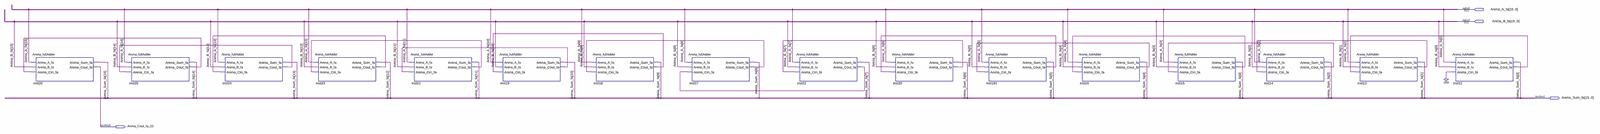
[diagram p0: schematic sheet, whole]
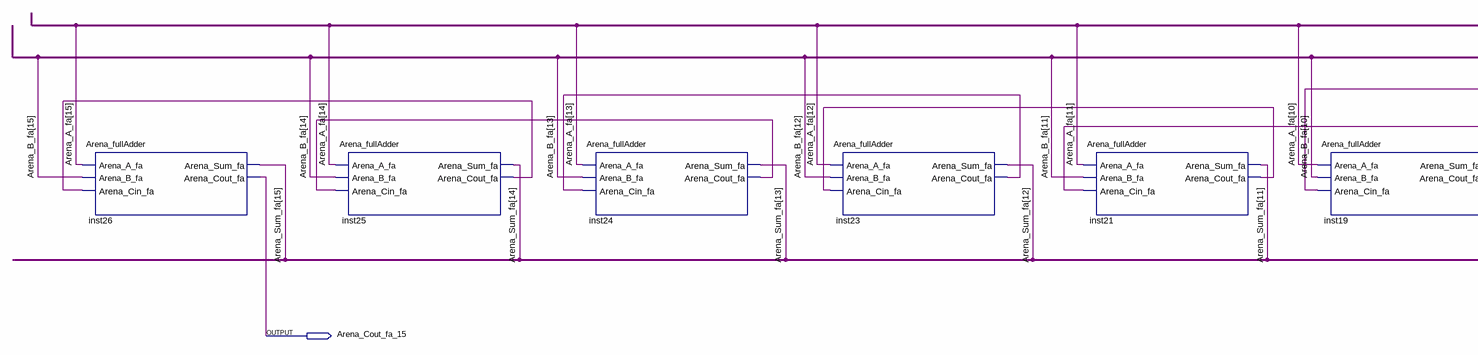
[diagram p1: schematic sheet, left part]
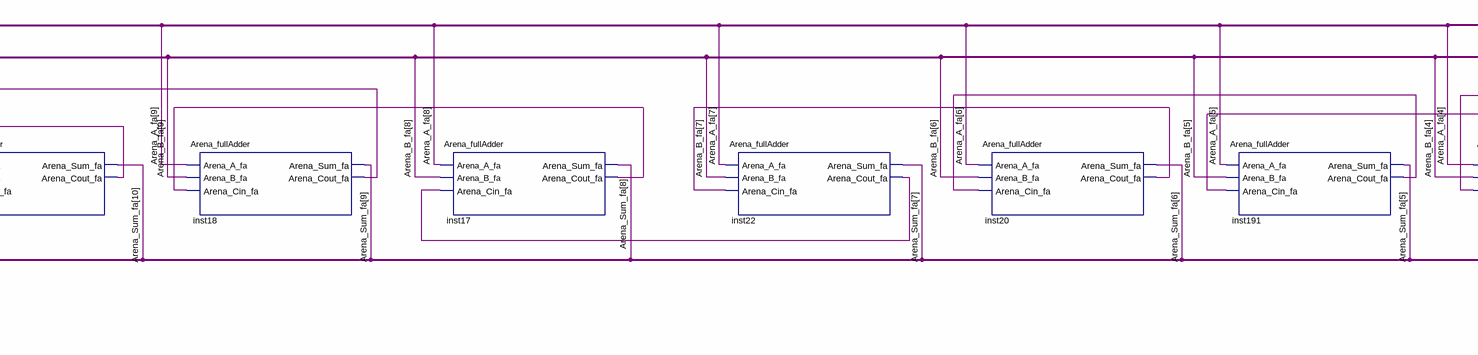
[diagram p2: schematic sheet, centre part]
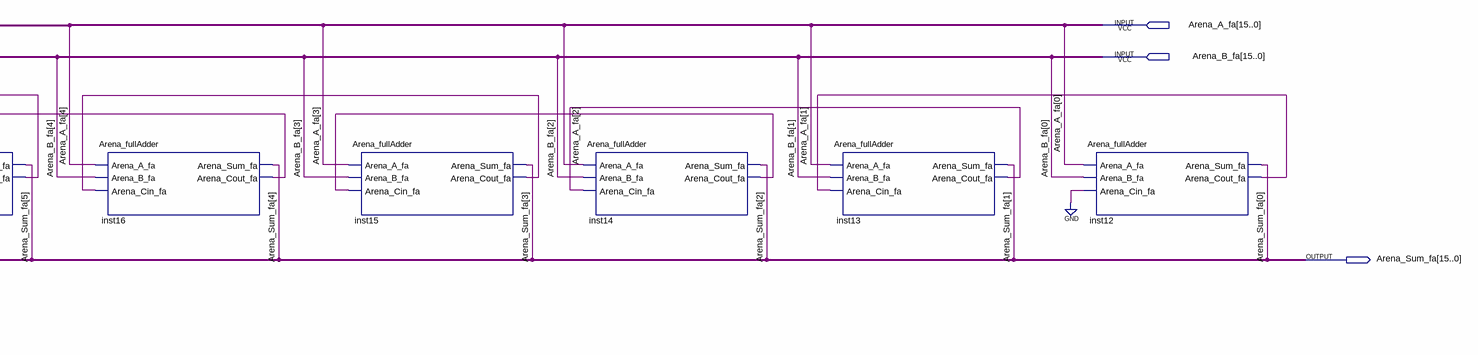
[diagram p3: schematic sheet, right part]
// Quartus schematic Arena_16bitAdder.bdf as structural Verilog: 16 symbols, 4 pins
module Arena_16bitAdder (
  input  [15:0] Arena_A_fa,
  input  [15:0] Arena_B_fa,
  output [15:0] Arena_Sum_fa,
  output Arena_Cout_fa_15
);

  wire inst12_arena_cout_fa, inst13_arena_cout_fa, inst14_arena_cout_fa, inst15_arena_cout_fa,
       inst16_arena_cout_fa, inst17_arena_cout_fa, inst18_arena_cout_fa, inst19_arena_cout_fa,
       inst20_arena_cout_fa, inst21_arena_cout_fa, inst22_arena_cout_fa, inst23_arena_cout_fa,
       inst24_arena_cout_fa, inst25_arena_cout_fa, inst191_arena_cout_fa;

  Arena_fullAdder inst26 (
    .Arena_A_fa(Arena_A_fa[15]), .Arena_B_fa(Arena_B_fa[15]), .Arena_Cin_fa(inst25_arena_cout_fa),
    .Arena_Sum_fa(Arena_Sum_fa[15]), .Arena_Cout_fa(Arena_Cout_fa_15));
  Arena_fullAdder inst25 (
    .Arena_A_fa(Arena_A_fa[14]), .Arena_B_fa(Arena_B_fa[14]), .Arena_Cin_fa(inst24_arena_cout_fa),
    .Arena_Sum_fa(Arena_Sum_fa[14]), .Arena_Cout_fa(inst25_arena_cout_fa));
  Arena_fullAdder inst24 (
    .Arena_A_fa(Arena_A_fa[13]), .Arena_B_fa(Arena_B_fa[13]), .Arena_Cin_fa(inst23_arena_cout_fa),
    .Arena_Sum_fa(Arena_Sum_fa[13]), .Arena_Cout_fa(inst24_arena_cout_fa));
  Arena_fullAdder inst23 (
    .Arena_A_fa(Arena_A_fa[12]), .Arena_B_fa(Arena_B_fa[12]), .Arena_Cin_fa(inst21_arena_cout_fa),
    .Arena_Sum_fa(Arena_Sum_fa[12]), .Arena_Cout_fa(inst23_arena_cout_fa));
  Arena_fullAdder inst21 (
    .Arena_A_fa(Arena_A_fa[11]), .Arena_B_fa(Arena_B_fa[11]), .Arena_Cin_fa(inst19_arena_cout_fa),
    .Arena_Sum_fa(Arena_Sum_fa[11]), .Arena_Cout_fa(inst21_arena_cout_fa));
  Arena_fullAdder inst19 (
    .Arena_A_fa(Arena_A_fa[10]), .Arena_B_fa(Arena_B_fa[10]), .Arena_Cin_fa(inst18_arena_cout_fa),
    .Arena_Sum_fa(Arena_Sum_fa[10]), .Arena_Cout_fa(inst19_arena_cout_fa));
  Arena_fullAdder inst18 (
    .Arena_A_fa(Arena_A_fa[9]), .Arena_B_fa(Arena_B_fa[9]), .Arena_Cin_fa(inst17_arena_cout_fa),
    .Arena_Sum_fa(Arena_Sum_fa[9]), .Arena_Cout_fa(inst18_arena_cout_fa));
  Arena_fullAdder inst17 (
    .Arena_A_fa(Arena_A_fa[8]), .Arena_B_fa(Arena_B_fa[8]), .Arena_Cin_fa(inst22_arena_cout_fa),
    .Arena_Sum_fa(Arena_Sum_fa[8]), .Arena_Cout_fa(inst17_arena_cout_fa));
  Arena_fullAdder inst22 (
    .Arena_A_fa(Arena_A_fa[7]), .Arena_B_fa(Arena_B_fa[7]), .Arena_Cin_fa(inst20_arena_cout_fa),
    .Arena_Sum_fa(Arena_Sum_fa[7]), .Arena_Cout_fa(inst22_arena_cout_fa));
  Arena_fullAdder inst20 (
    .Arena_A_fa(Arena_A_fa[6]), .Arena_B_fa(Arena_B_fa[6]), .Arena_Cin_fa(inst191_arena_cout_fa),
    .Arena_Sum_fa(Arena_Sum_fa[6]), .Arena_Cout_fa(inst20_arena_cout_fa));
  Arena_fullAdder inst191 (
    .Arena_A_fa(Arena_A_fa[5]), .Arena_B_fa(Arena_B_fa[5]), .Arena_Cin_fa(inst16_arena_cout_fa),
    .Arena_Sum_fa(Arena_Sum_fa[5]), .Arena_Cout_fa(inst191_arena_cout_fa));
  Arena_fullAdder inst16 (
    .Arena_A_fa(Arena_A_fa[4]), .Arena_B_fa(Arena_B_fa[4]), .Arena_Cin_fa(inst15_arena_cout_fa),
    .Arena_Sum_fa(Arena_Sum_fa[4]), .Arena_Cout_fa(inst16_arena_cout_fa));
  Arena_fullAdder inst15 (
    .Arena_A_fa(Arena_A_fa[3]), .Arena_B_fa(Arena_B_fa[3]), .Arena_Cin_fa(inst14_arena_cout_fa),
    .Arena_Sum_fa(Arena_Sum_fa[3]), .Arena_Cout_fa(inst15_arena_cout_fa));
  Arena_fullAdder inst14 (
    .Arena_A_fa(Arena_A_fa[2]), .Arena_B_fa(Arena_B_fa[2]), .Arena_Cin_fa(inst13_arena_cout_fa),
    .Arena_Sum_fa(Arena_Sum_fa[2]), .Arena_Cout_fa(inst14_arena_cout_fa));
  Arena_fullAdder inst13 (
    .Arena_A_fa(Arena_A_fa[1]), .Arena_B_fa(Arena_B_fa[1]), .Arena_Cin_fa(inst12_arena_cout_fa),
    .Arena_Sum_fa(Arena_Sum_fa[1]), .Arena_Cout_fa(inst13_arena_cout_fa));
  Arena_fullAdder inst12 (
    .Arena_A_fa(Arena_A_fa[0]), .Arena_B_fa(Arena_B_fa[0]), .Arena_Cin_fa(1'b0),
    .Arena_Sum_fa(Arena_Sum_fa[0]), .Arena_Cout_fa(inst12_arena_cout_fa));
endmodule
